# Altium schematic sheet power.SchDoc: Battery and power
size A4; Author: Samuel López; DocumentNumber: 1; SheetNumber: 1; SheetTotal: 1
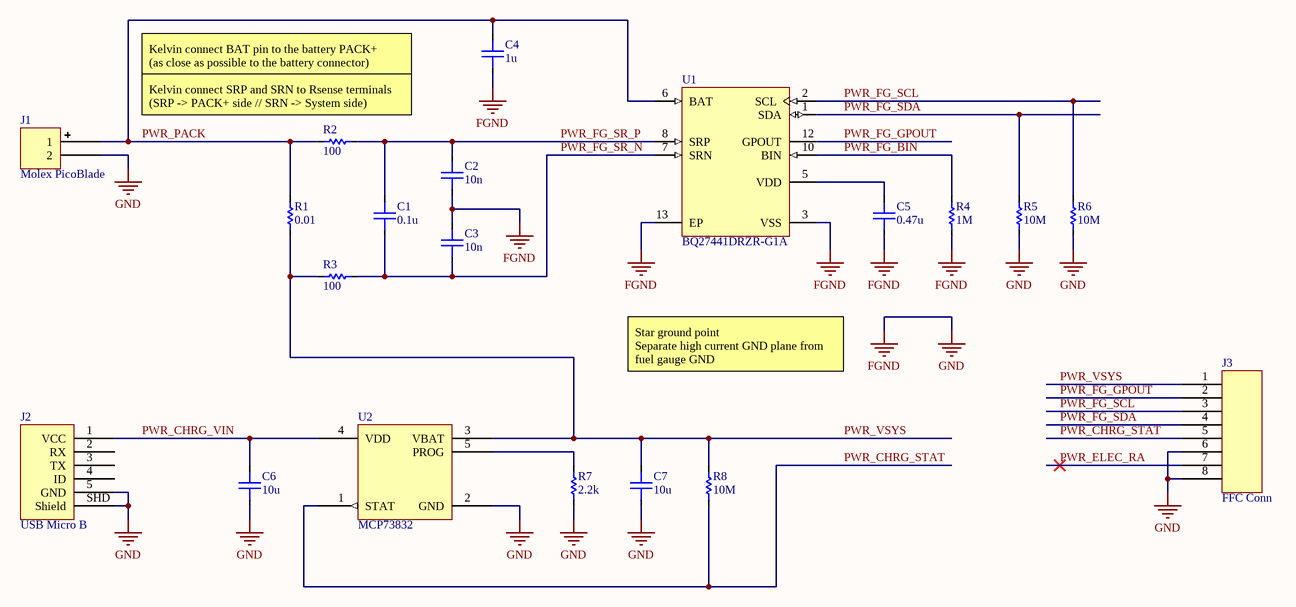
[diagram p0: power.SchDoc]

## Parts
C1  0.1u  [C0402]
C2  10n  [C0402]
C3  10n  [C0402]
C4  1u  [C0402]
C5  0.47u  [C0402]
C6  10u  [C0603]
C7  10u  [C0603]
J1  Molex PicoBlade  [Molex 53261-0271]
J2  USB Micro B  [Amphenol FCI 10118192-0001LF]
J3  FFC Conn  [WE68610814122]
R1  0.01  [R0603]
R2  100  [R0402]
R3  100  [R0402]
R4  1M  [R0402]
R5  10M  [R0402]
R6  10M  [R0402]
R7  2.2k  [R0402]
R8  10M  [R0402]
U1  BQ27441DRZR-G1A  [BQ27441DRZx-G1A]
U2  MCP73832  [MCP7383X]

## Nets
FGND: C2.1 C3.2 C4.1 C5.1 C6.1 C7.1 J1.2 J2.5(GND) J2.SHD(Shield) J3.6 J3.8 R4.1 R5.1 R6.1 R7.2 U1.3(VSS) U1.13(EP) U2.2(GND)  [also labelled GND]
PWR_CHRG_STAT: J3.5 R8.1 U2.1(STAT)
PWR_CHRG_VIN: C6.2 J2.1(VCC) U2.4(VDD)
PWR_ELEC_RA: J3.7
PWR_FG_BIN: R4.2 U1.10(BIN)
PWR_FG_GPOUT: J3.2 U1.12(GPOUT)
PWR_FG_SCL: J3.3 R6.2 U1.2(SCL)
PWR_FG_SDA: J3.4 R5.2 U1.1(SDA)
PWR_FG_SR_N: C1.1 C3.1 R3.2 U1.7(SRN)
PWR_FG_SR_P: C1.2 C2.2 R2.2 U1.8(SRP)
PWR_PACK: C4.2 J1.1 R1.1 R2.1 U1.6(BAT)
PWR_VSYS: C7.2 J3.1 R1.2 R3.1 R8.2 U2.3(VBAT)
NetC5_2: C5.2 U1.5(VDD)
NetR7_1: R7.1 U2.5(PROG)

Not connected (* = marked no-connect by the designer): J2 2(RX) 3(TX) 4(ID)

## Notes on the sheet
- Kelvin connect BAT pin to the battery PACK+
  (as close as possible to the battery connector)
- (near R2) Kelvin connect SRP and SRN to Rsense terminals
  (SRP -> PACK+ side // SRN -> System side)
- Star ground point
  Separate high current GND plane from
  fuel gauge GND
- Title:
- Sheet
- of
- Author:
- Date:
- Time:

## Library data of the parts
C1-C7 = Capacitor: Rated Voltage: *
  C1: Value: 0.1u
  C2 C3: Value: 10n
  C4: Value: 1u
  C5: Value: 0.47u
  C6 C7: Value: 10u
J1 = Molex 53261-0271: Conn - Battery, PicoBlade, Male, 2 Pin, SMD, Right Angle; Supplier 1: Digi-Key; Supplier Part Number 1: WM7620CT-ND
J2 = Amphenol FCI 10118192-0001LF: Conn - USB Micro B, SMD, Receptacle; Supplier 1: Digi-Key; Supplier Part Number 1: 609-4613-1-ND
J3 = WE68610814122: Conn - FFC, 8 Pin, 1 mm Pitch, Top Contacts, SMD, Right Angle, Slide Lock; Supplier 1: Digi-Key; Supplier Part Number 1: 732-2003-1-ND
R1-R8 = Resistor: Power: *
  R1: Value: 0.01
  R2 R3: Value: 100
  R4: Value: 1M
  R5 R6 R8: Value: 10M
  R7: Value: 2.2k
U1 = BQ27441DRZR-G1A: IC - Fuel Gauge, System-Side Impedance Track; PartNumber: BQ27410DRZR-G1A; Manufacturer: Texas Instruments; Eco-Plan: Green (RoHS & no Sb/Br); Lead Acid: N; Li-Ion: Y; SubFamily: Battery Fuel Gauge; DatasheetVersion: SLUSAF4; PackageVersion: revB, Apr-2006; PackageReference: DRZ12-1950X2450TP; PackageDescription: 12-Pin Plastic Small Outline No-Lead, 4 x 2.5 x 1 mm Body, 0.4 mm Pitch, Exposed Pad, Pb-Free; Li-Polymer: Y; NiCd: N; NiMH: N; Over Voltage Protection: N; Mounting Technology: Surface Mount; ComponentLink1Description: Datasheet; ComponentLink1URL: http://www.ti.com/general/docs/lit/getliterature.tsp?genericPartNumber=BQ27410-G1&fileType=pdf; Supplier 1: Digi-Key; Supplier Part Number 1: 296-39941-1-ND
U2 = MCP73832: IC - Battery Charger, Single Cell Li-Ion/LiPo, 0.5A; Supplier 1: Digi-Key; Supplier Part Number 1: MCP73832T-2ACI/OTCT-ND